# Altium schematic sheet MC21R01 Revision history.SchDoc: des_temp
size A4 portrait; CompanyName: PAL Robotics; DrawnBy: Jose, Laszlo; Engineer: Jose Hidalgo, László Szabados; DocumentNumber: 1; Revision: 1.00; SheetNumber: 1; SheetTotal: 9
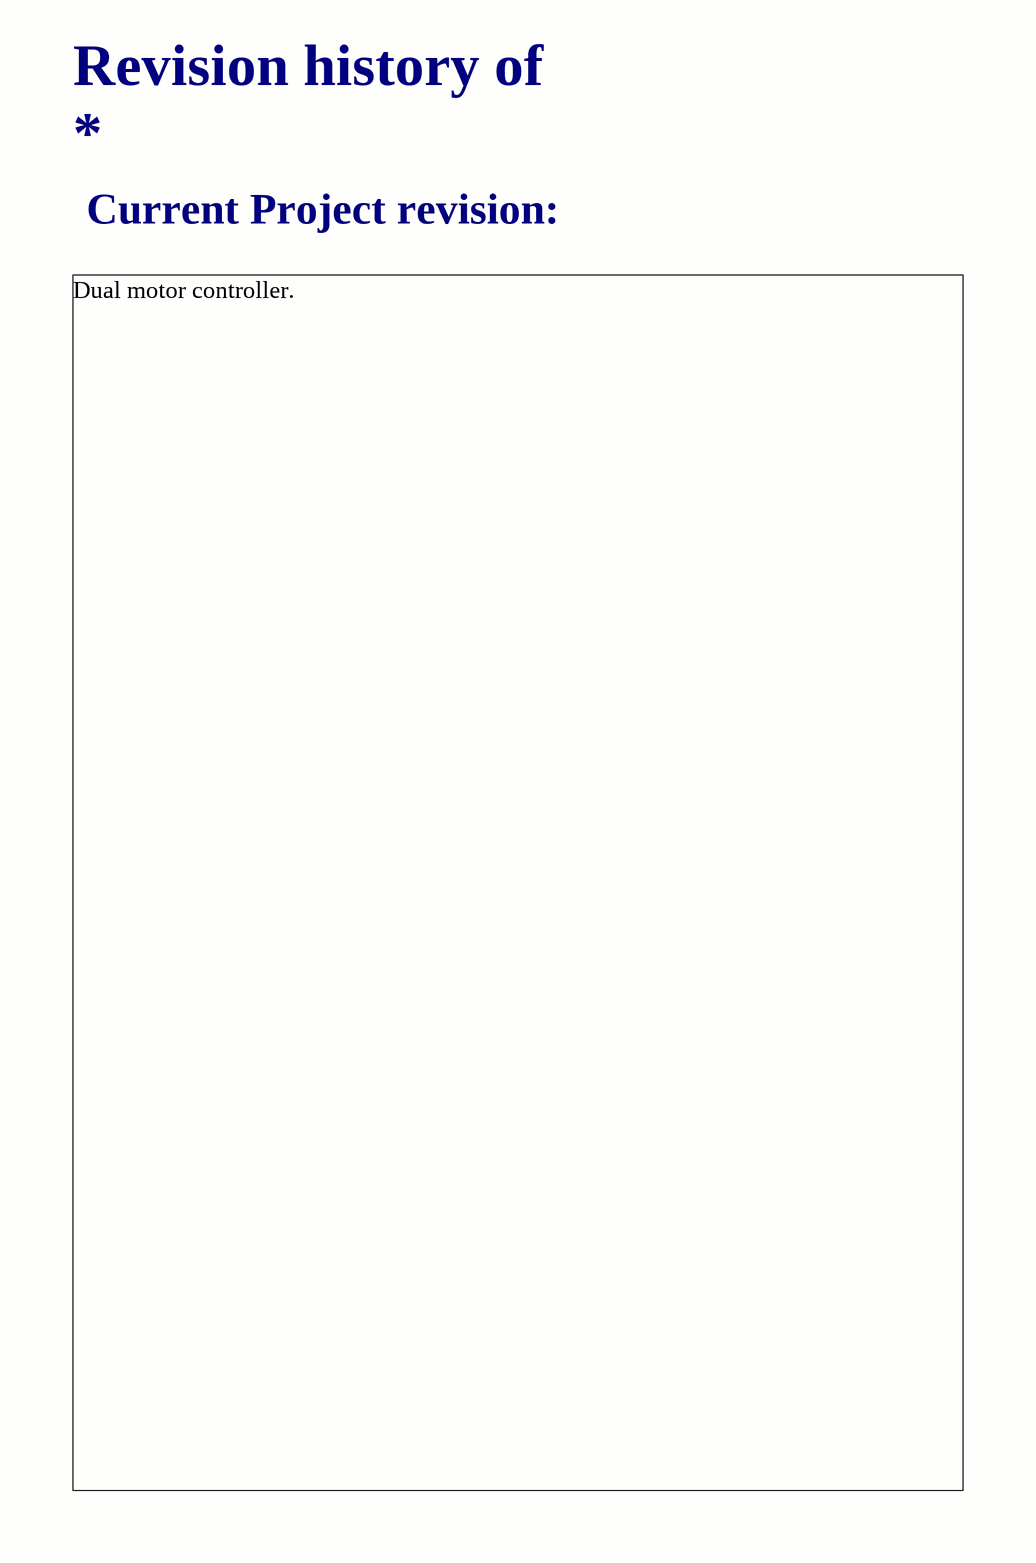
[diagram p0: MC21R01 Revision history.SchDoc]

## Notes on the sheet
- Revision history of
- Current Project revision:
- Dual motor controller.